# EAGLE design 2 bucks_a and s (EAGLE 9.5.1)
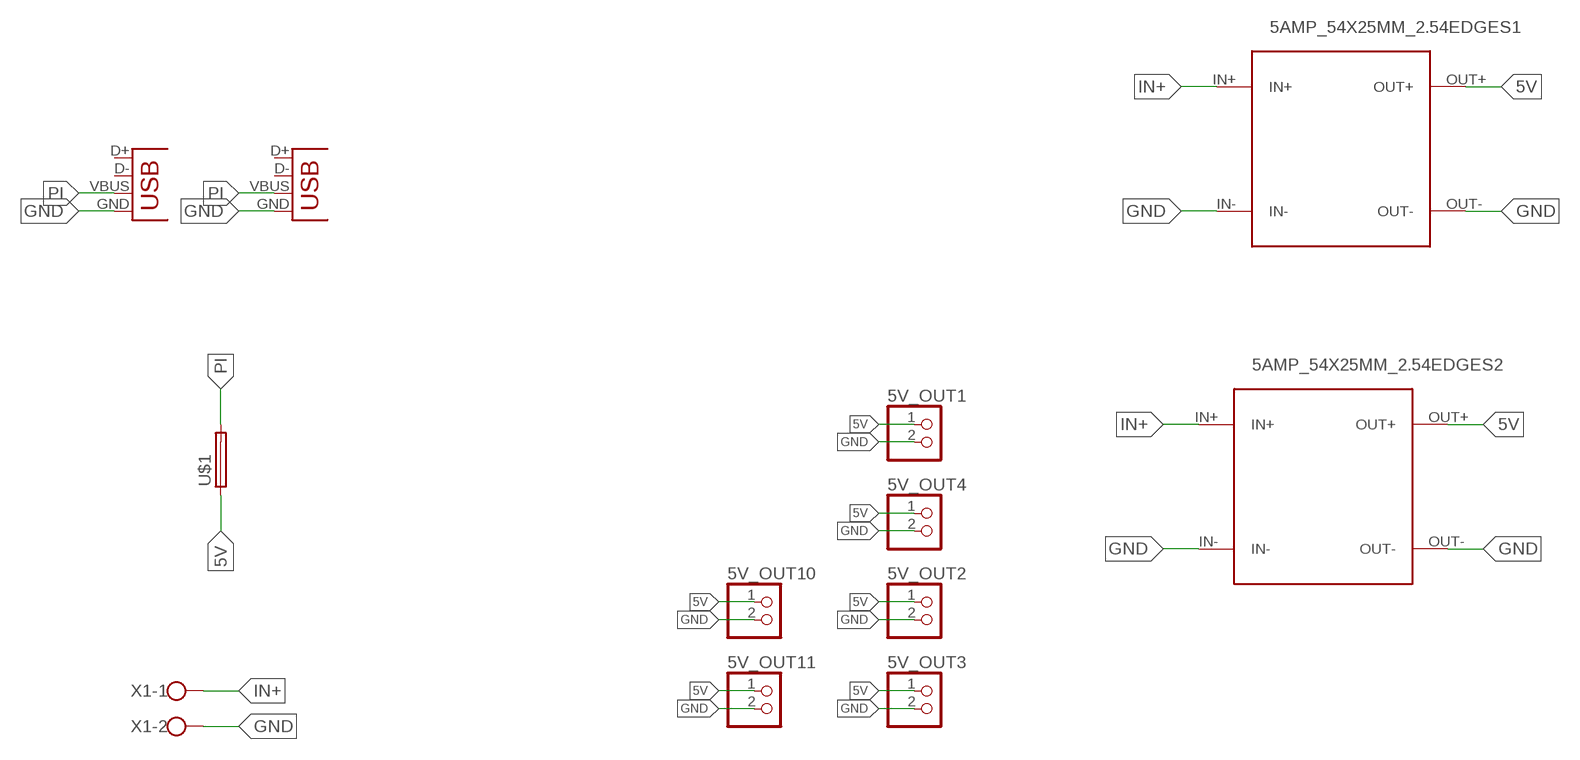
[diagram p0: schematic, sheet 1]

## Parts
5AMP_54X25MM_2.54EDGES1  BUCKCONVERTER_5AMP_54X25MM  [BUCKCONVERTER_5AMP_54X25MM]
5AMP_54X25MM_2.54EDGES2  BUCKCONVERTER_5AMP_54X25MM  [BUCKCONVERTER_5AMP_54X25MM]
5V_OUT1  PINHD-2_DATA  [1X02_DATA]
5V_OUT2  PINHD-2_DATA  [1X02_DATA]
5V_OUT3  PINHD-2_DATA  [1X02_DATA]
5V_OUT4  PINHD-2_DATA  [1X02_DATA]
5V_OUT10  PINHD-2_DATA  [1X02_DATA]
5V_OUT11  PINHD-2_DATA  [1X02_DATA]
U$1  FUSE_HOLDER  [SH22,5A]
X1  ROSTA.POWER  [W239-302]
X2  USB-A-H  [USB-A-H]
X4  USB-A-H  [USB-A-H]

## Nets
5V: 5AMP_54X25MM_2.54EDGES1.OUT+ 5AMP_54X25MM_2.54EDGES2.OUT+ 5V_OUT1.1 5V_OUT2.1 5V_OUT3.1 5V_OUT4.1 5V_OUT10.1 5V_OUT11.1 U$1.1
GND: 5AMP_54X25MM_2.54EDGES1.IN- 5AMP_54X25MM_2.54EDGES1.OUT- 5AMP_54X25MM_2.54EDGES2.IN- 5AMP_54X25MM_2.54EDGES2.OUT- 5V_OUT1.2 5V_OUT2.2 5V_OUT3.2 5V_OUT4.2 5V_OUT10.2 5V_OUT11.2 X1.2 X2.GND X4.GND
IN+: 5AMP_54X25MM_2.54EDGES1.IN+ 5AMP_54X25MM_2.54EDGES2.IN+ X1.1
PI: U$1.2 X2.VBUS X4.VBUS
Unconnected: X2.D+ X2.D- X4.D+ X4.D-

## Library data of the parts
5AMP_54X25MM_2.54EDGES1 5AMP_54X25MM_2.54EDGES2 = BUCK:BUCKCONVERTER_5AMP_54X25MM
5V_OUT1-5V_OUT4 5V_OUT10 5V_OUT11 = MIA_LIBRARY-2-2-2:PINHD-2_DATA: PIN HEADER
U$1 = MIA_LIBRARY-2-2-2:FUSE_HOLDER
X1 = MIA_LIBRARY-2-2-2:ROSTA.POWER: WAGO SCREW CLAMP; OC_FARNELL: unknown; OC_NEWARK: unknown
X2 X4 = MIA_LIBRARY-2-2-2:USB: USB Connectors

## Board
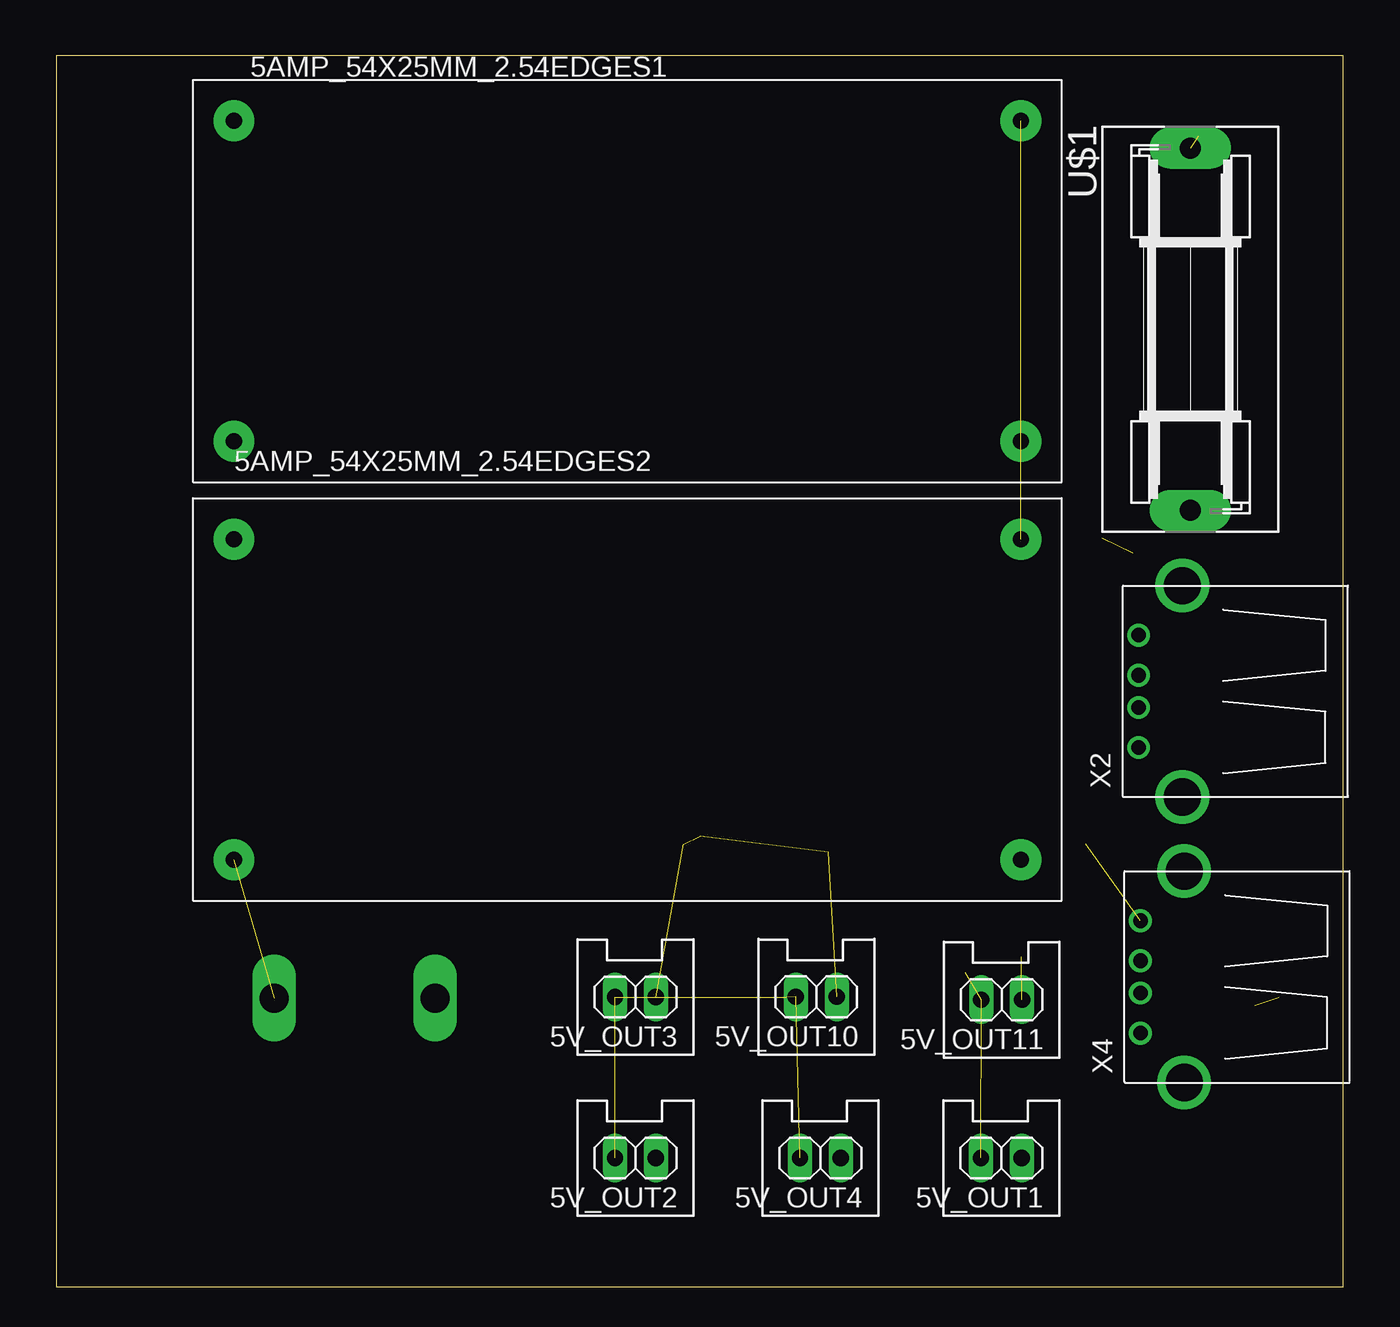
[diagram p1: board, top side]
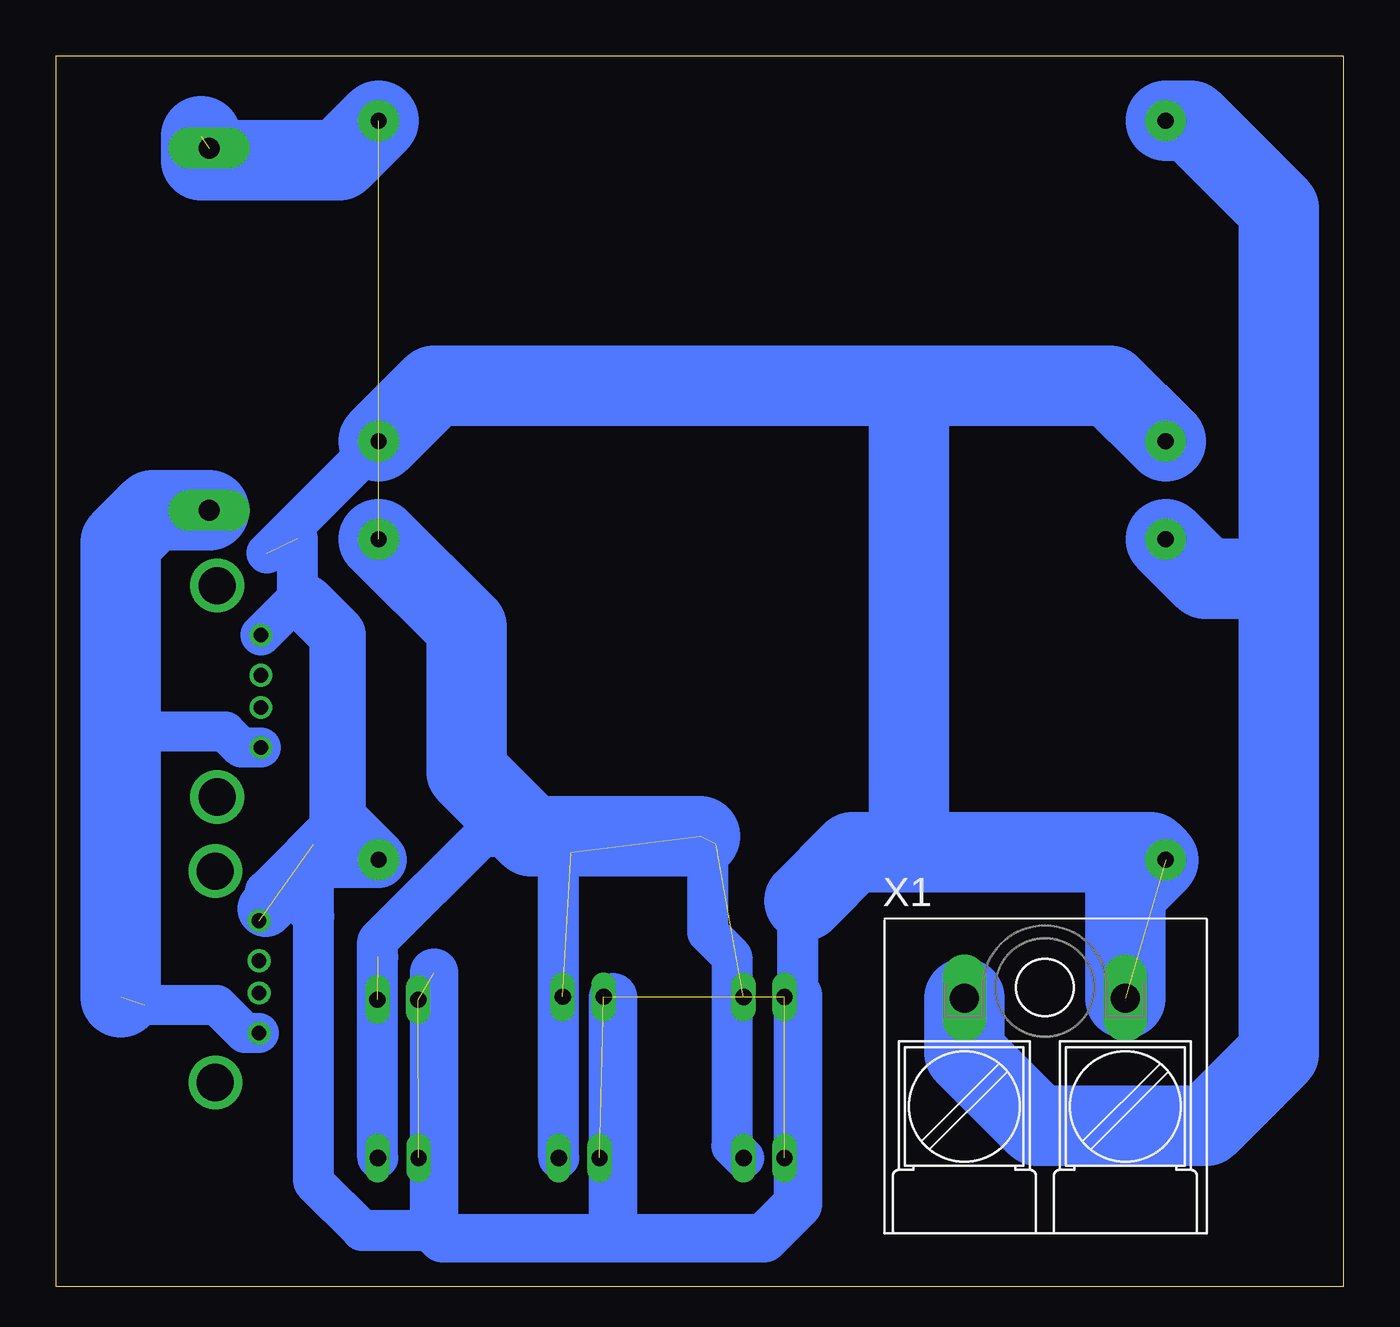
[diagram p2: board, bottom side, seen from below]

Size 80 x 76.5 mm. Coordinates in mm from the lower left corner, seen from the top.
Outline: 0,0 80,0 80,76.5 0,76.5 0,0
Copper layers (1*16): Top 0.035mm / dielectric 1.5mm / Bottom 0.035mm
Design rules "default": minimum track width 6mil, minimum drill 0.35mm, track to track 6mil, track to pad 6mil, pad to pad 6mil, via to via 6mil, smd to smd 6mil, copper to edge 40mil, drill to drill 6mil, minimum pad ring 10mil, minimum via ring 8mil, stop-mask expansion 4mil, vias tented up to drill 0mil, thermal gap 10mil

### Footprints (pad centres in the part's own frame; a part is rotated, then mirrored left to right if it is on the bottom)
BUCKCONVERTER_5AMP_54X25MM = drill 1 pad 2.54: IN+ 2.54,22.46; IN- 2.54,2.54; OUT+ 51.46,22.46; OUT- 51.46,2.54
1X02_DATA = drill 1.016 long: 1 -1.27,0; 2 1.27,0
SH22,5A = drill 1.321 pad 2.54 long: 1 -11.252,0; 2 11.252,0
W239-302 = drill 1.8 long: 1 -5,5; 2 5,5
USB-A-H = drill 0.914: D+ 2.718,-1.003; D- 2.718,1.003; GND 2.718,-3.493; VBUS 2.718,3.493 | drill 2.311: P$5 0,-6.566; P$6 0,6.566

### Placement (x,y rotation side)
5AMP_54X25MM_2.54EDGES1  8.5,50 0 top
5AMP_54X25MM_2.54EDGES2  8.5,24 0 top
5V_OUT1  58.75,8 180 top
5V_OUT2  36,8 180 top
5V_OUT3  36,18 180 top
5V_OUT4  47.5,8 180 top
5V_OUT10  47.25,18.02 180 top
5V_OUT11  58.77,17.84 180 top
U$1  70.5,59.5 270 top
X1  18.55,12.93 0 bottom
X2  70,37 180 top
X4  70.12,19.25 180 top

### Tracks (layer width: path | path; a pad name or v marks a point on that pad's centre or on a via)
5V  (7 unrouted)
  Bottom 2.54: 5V_OUT2.1 38,8.73 38,20.5 39.5,22 39.5,27 39,27.5 | 5V_OUT1.1 60.02,20.48 | 60,20.5 60.02,20.48 | 48,27 48.77,26.23 5V_OUT4.1 | 60.02,20.48 60.02,21.48 53.5,28 46.5,28
  Bottom 5: 5AMP_54X25MM_2.54EDGES2.OUT+ 54.5,41 54.5,32 50.5,28 46.5,28 40,28 | 5AMP_54X25MM_2.54EDGES1.OUT+ 62.42,70 71,70 71,71.5
GND  (9 unrouted)
  Bottom 2.54: 33.88,18.12 33.88,23.62 33.5,24 | 5AMP_54X25MM_2.54EDGES1.OUT- 66.91,45.59 | X2.GND 65,42.77 65,46.5 | 56.5,3.5 61,3.5 64,6.5 64,23 | 65.75,24.75 64,23 | 64,23 64,27.5 | 62.5,29.08 67,24.58 67,23.5
  Bottom 3: 45.38,3 36,3 33.88,5.12 33.88,18.12 | 45.38,3 56,3 56.5,3.5 56.5,19.5 | 45.38,3 45.38,18
  Bottom 3.5: 64.5,42.5 62.5,40.5 62.5,29.08 5AMP_54X25MM_2.54EDGES2.OUT- 63.96,26.54 65.75,24.75 67,23.5
  Bottom 5: 5AMP_54X25MM_2.54EDGES1.IN- 14.5,56 27,56 | 5AMP_54X25MM_2.54EDGES1.OUT- 56.5,56 27,56 | X1.2 13.55,24.45 11.5,26.5 12,27 27,27 | 33.5,24 30.5,27 27,27 | 27,27 27,56
IN+
  Bottom 5: X1.1 23.55,14.55 19,10 8.5,10 4,14.5 4,43 | 5AMP_54X25MM_2.54EDGES1.IN+ 9.46,72.46 4,67 4,66.5 4,62.5 4,43 | 5AMP_54X25MM_2.54EDGES2.IN+ 8.58,44 5,44 4,43
PI  (1 unrouted)
  Bottom 2.5: X2.VBUS 68.51,33.51 69.5,34.5 76,34.5 | X4.VBUS 68.26,15.76 70,17.5 74.5,17.5
  Bottom 3: 75.75,34.75 76,34.5 75.25,33.75
  Bottom 5: U$1.2 74,48.25 76,46.25 76,34.5 76,18